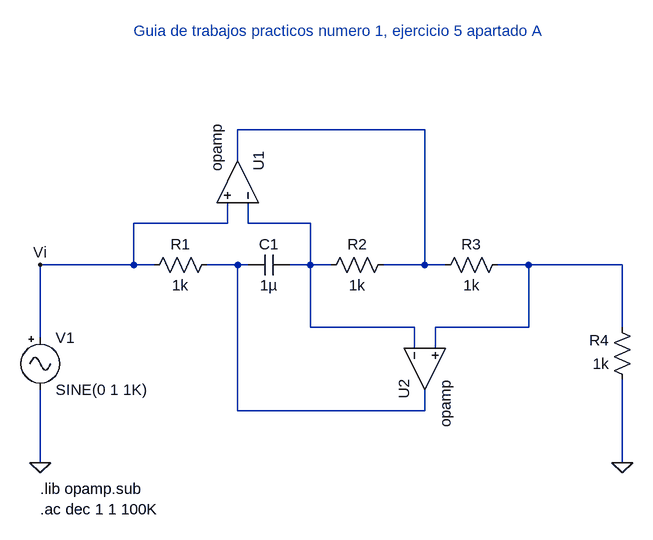
[diagram p0: schematic tp_1_5_a.asc]
tp_1_5_a.asc, the LTspice schematic file:
Version 4
SHEET 1 964 680
WIRE 608 16 320 16
WIRE 320 64 320 16
WIRE 304 160 304 128
WIRE 304 160 160 160
WIRE 336 160 336 128
WIRE 432 160 336 160
WIRE 160 224 160 160
WIRE 160 224 16 224
WIRE 192 224 160 224
WIRE 320 224 272 224
WIRE 336 224 320 224
WIRE 432 224 432 160
WIRE 432 224 400 224
WIRE 464 224 432 224
WIRE 608 224 608 16
WIRE 608 224 544 224
WIRE 640 224 608 224
WIRE 768 224 720 224
WIRE 912 224 768 224
WIRE 432 320 432 224
WIRE 592 320 432 320
WIRE 768 320 768 224
WIRE 768 320 624 320
WIRE 912 320 912 224
WIRE 16 336 16 224
WIRE 592 352 592 320
WIRE 624 352 624 320
WIRE 320 448 320 224
WIRE 608 448 608 416
WIRE 608 448 320 448
WIRE 16 528 16 416
WIRE 912 528 912 400
FLAG 16 528 0
FLAG 16 224 Vi
FLAG 912 528 0
SYMBOL Misc/signal 16 320 R0
SYMATTR InstName V1
SYMATTR Value2 AC 1
SYMBOL res 288 208 R90
WINDOW 0 0 56 VBottom 2
WINDOW 3 32 56 VTop 2
SYMATTR InstName R1
SYMATTR Value 1k
SYMBOL res 560 208 R90
WINDOW 0 0 56 VBottom 2
WINDOW 3 32 56 VTop 2
SYMATTR InstName R2
SYMATTR Value 1k
SYMBOL res 736 208 R90
WINDOW 0 0 56 VBottom 2
WINDOW 3 32 56 VTop 2
SYMATTR InstName R3
SYMATTR Value 1k
SYMBOL res 928 416 R180
WINDOW 0 36 76 Left 2
WINDOW 3 36 40 Left 2
SYMATTR InstName R4
SYMATTR Value 1k
SYMBOL cap 400 208 R90
WINDOW 0 0 32 VBottom 2
WINDOW 3 32 32 VTop 2
SYMATTR InstName C1
SYMATTR Value 1µ
SYMBOL Opamps/opamp 384 96 M270
SYMATTR InstName U1
SYMBOL Opamps/opamp 544 384 M90
SYMATTR InstName U2
TEXT 16 568 Left 2 !.lib opamp.sub
TEXT 16 600 Left 2 !.ac dec 1 1 100K
TEXT 160 -136 Left 2 ;Guia de trabajos practicos numero 1, ejercicio 5 apartado A

The netlist it stands for:
* tp_1_5_a.asc
V1 Vi 0 SINE(0 1 1K) AC 1
R1 N003 Vi 1k
R2 N001 N002 1k
R3 N004 N001 1k
R4 0 N004 1k
C1 N002 N003 1µ
XU1 N002 Vi N001 opamp Aol=100K GBW=10Meg  ; pins invin noninvin out
XU2 N002 N004 N003 opamp Aol=100K GBW=10Meg  ; pins invin noninvin out
.lib opamp.sub
.ac dec 1 1 100K
* Guia de trabajos practicos numero 1, ejercicio 5 apartado A
.backanno
.end